# Altium schematic sheet Pump-Relay Blown Fuse Indicator.SchDoc
size A
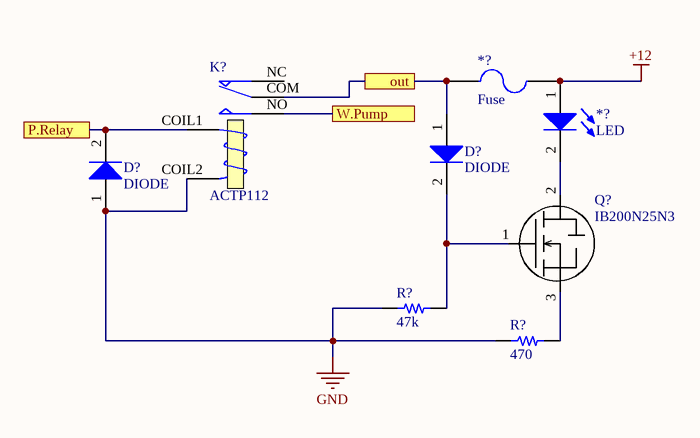
[diagram p0: Pump-Relay Blown Fuse Indicator.SchDoc]

## Parts
(Parts that share a designator on the sheet are numbered #1, #2 ... from top to bottom, then left to right.)
*?#1  Fuse
*?#2  LED  [0805_LED]
D?#1  DIODE  [SODFL350X115-2M]
D?#2  DIODE  [SODFL350X115-2M]
K?  ACTP112  [ACTP112]
Q?  IB200N25N3  [DPAK254P1524X457-3N]
R?#1  value 47k  [RES 0805/2012]  (hidden comment: Resistor 47k 0805 1/10W 1%)
R?#2  value 470  [RES 0805/2012]  (hidden comment: Resistor 470 0805 1/10W 1%)

## Ports
out, P.Relay, W.Pump

## Nets
+12: *?#1.2 *?#2.1(A)
GND: D?#2.1(A) K?.COIL2(T2) R?#1.2 R?#2.2
out: *?#1.1 D?#1.1(A) K?.COM ; port out
P.Relay: D?#2.2(K) K?.COIL1(T1) ; port P.Relay
W.Pump: K?.NO ; port W.Pump
Net*?#2_2: *?#2.2(K) Q?.2(D)
NetD?#1_2: D?#1.2(K) Q?.1(Gate) R?#1.1
NetQ?_3: Q?.3(Source) R?#2.1

Not connected (* = marked no-connect by the designer): K? NC

## Library data of the parts
*?#2 = 1: idLED: 1; Name: LED_0805_RED; Value: Red; Vf: 0.7V; Manufacturer_id: 1; Drawer_id: 1
D?#1 D?#2 = 2: Diode Super Barrier 40V 1A Surface Mount SOD-123F; Manufacturer_id: 1; MfrPartNo: 1N5819HW1-7-F; idDiode: 2; Name: 1N5819; Drawer_id: 1; Value: 1A; Type: Super Barrier; Num_Circuits: 1; Ic: 1A; Power: 40V; Package: SOD-123; Link: https://www.digikey.com/product-detail/en/diodes-incorporated/1N5819HW1-7-F/1N5819HW1-7-FDITR-ND/5768523; ComponentLink1Description: Datasheet; ComponentLink1URL: https://www.diodes.com/assets/Datasheets/1N5819HW1.pdf; Supplier1: Digi-Key; Supplier1PartNo: 1N5819HW1-7-FDITR-ND
K? = 3: Manufacturer_id: 1; idRelay: 3; Coil_Voltage: 12V; Published: 8-Jun-2000; LatestRevisionDate: 17-Jul-2002; LatestRevisionNote: Re-released for DXP Platform.; PackageReference: MODULE5B; Publisher: Altium Limited; Drawer_id: 1; Name: ACTP112
Q? = 1: MOSFET N-Ch 250V 64A D2PAK-2 OptiMOS 3; MfrPartNo: IPB200N25N3; idFETs: 1; Name: TO-263-3_64A; Value: 250V_64A; Rds_On: 20m; Vgs(Max): 20V; Power(Max): 300W; ComponentLink1Description: Mouser Part; ComponentLink1URL: https://www.mouser.com/ProductDetail/Infineon-Technologies/IPB200N25N3-G?qs=sGAEpiMZZMshyDBzk1%2fWi5eGkr%252bPRUK3FK%2fjPTagUYc%3d; Manufacturer_id: 1; Drawer_id: 1; Vdss: 250V; Num_Circuits: 1; Id: 64A; Package: TO-263-3; Link: https://www.mouser.com/ProductDetail/Infineon-Technologies/IPB200N25N3-G?qs=sGAEpiMZZMshyDBzk1%2fWi5eGkr%252bPRUK3FK%2fjPTagUYc%3d; Supplier1: Mouser; Supplier1PartNo: 726-IPB200N25N3GXT
R?#1 = 545: Manufacturer_id: 1; idResistor: 545; Name: Res_47k_0805_1/10W_1%; Created_By: Nick Mah; Supplier 1: Digi-Key; Drawer_id: 1; Tolerance: 1%; Power: 1/10W; Package: 0805; ComponentLink1Description: Datasheet; Created_Date: 2018-10-20
R?#2 = 497: Manufacturer_id: 1; idResistor: 497; Name: Res_470_0805_1/10W_1%; Created_By: Nick Mah; Supplier 1: Digi-Key; Drawer_id: 1; Tolerance: 1%; Power: 1/10W; Package: 0805; ComponentLink1Description: Datasheet; Created_Date: 2018-10-20